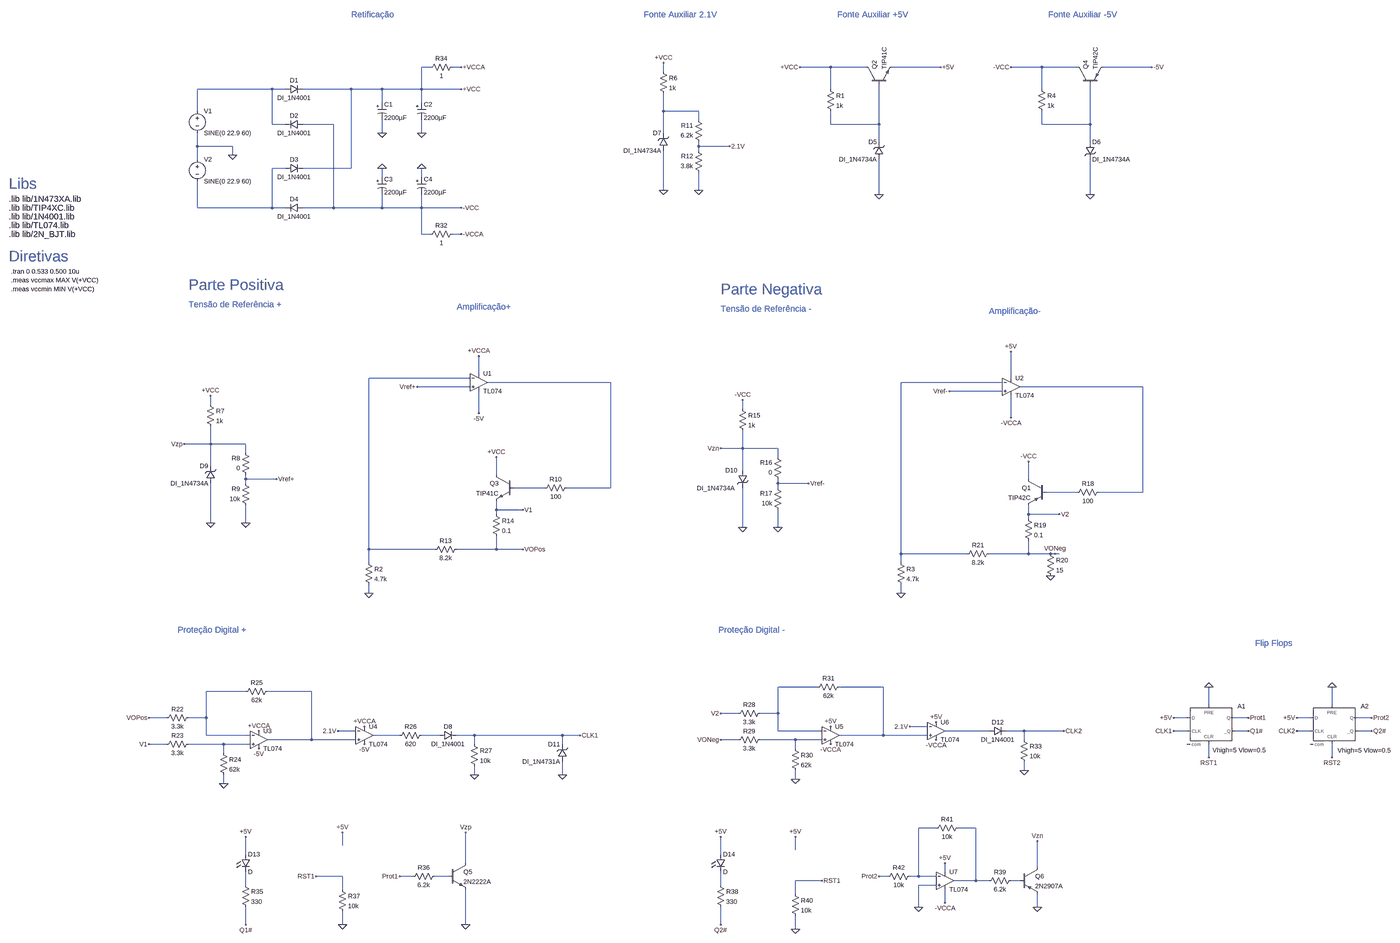
[diagram p0: schematic FonteCC-ELT1.asc, whole sheet]
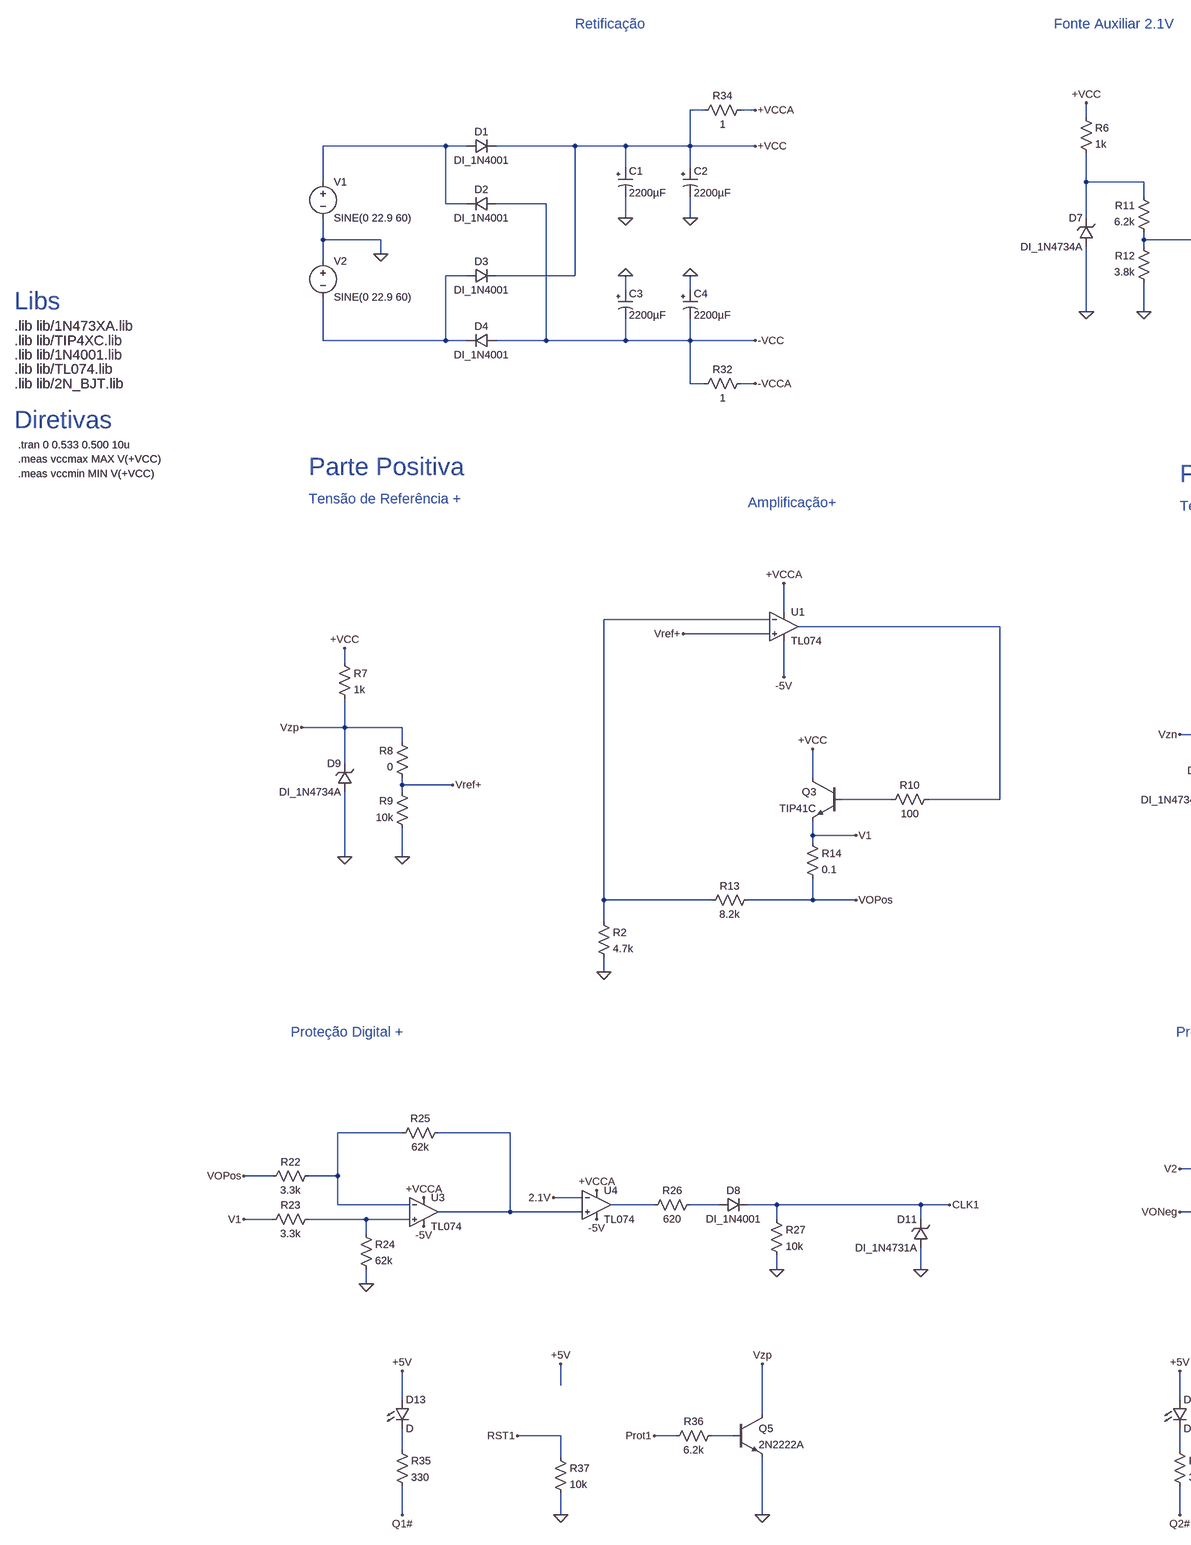
[diagram p1: schematic FonteCC-ELT1.asc, part, row 1 of 1, column 1 of 2]
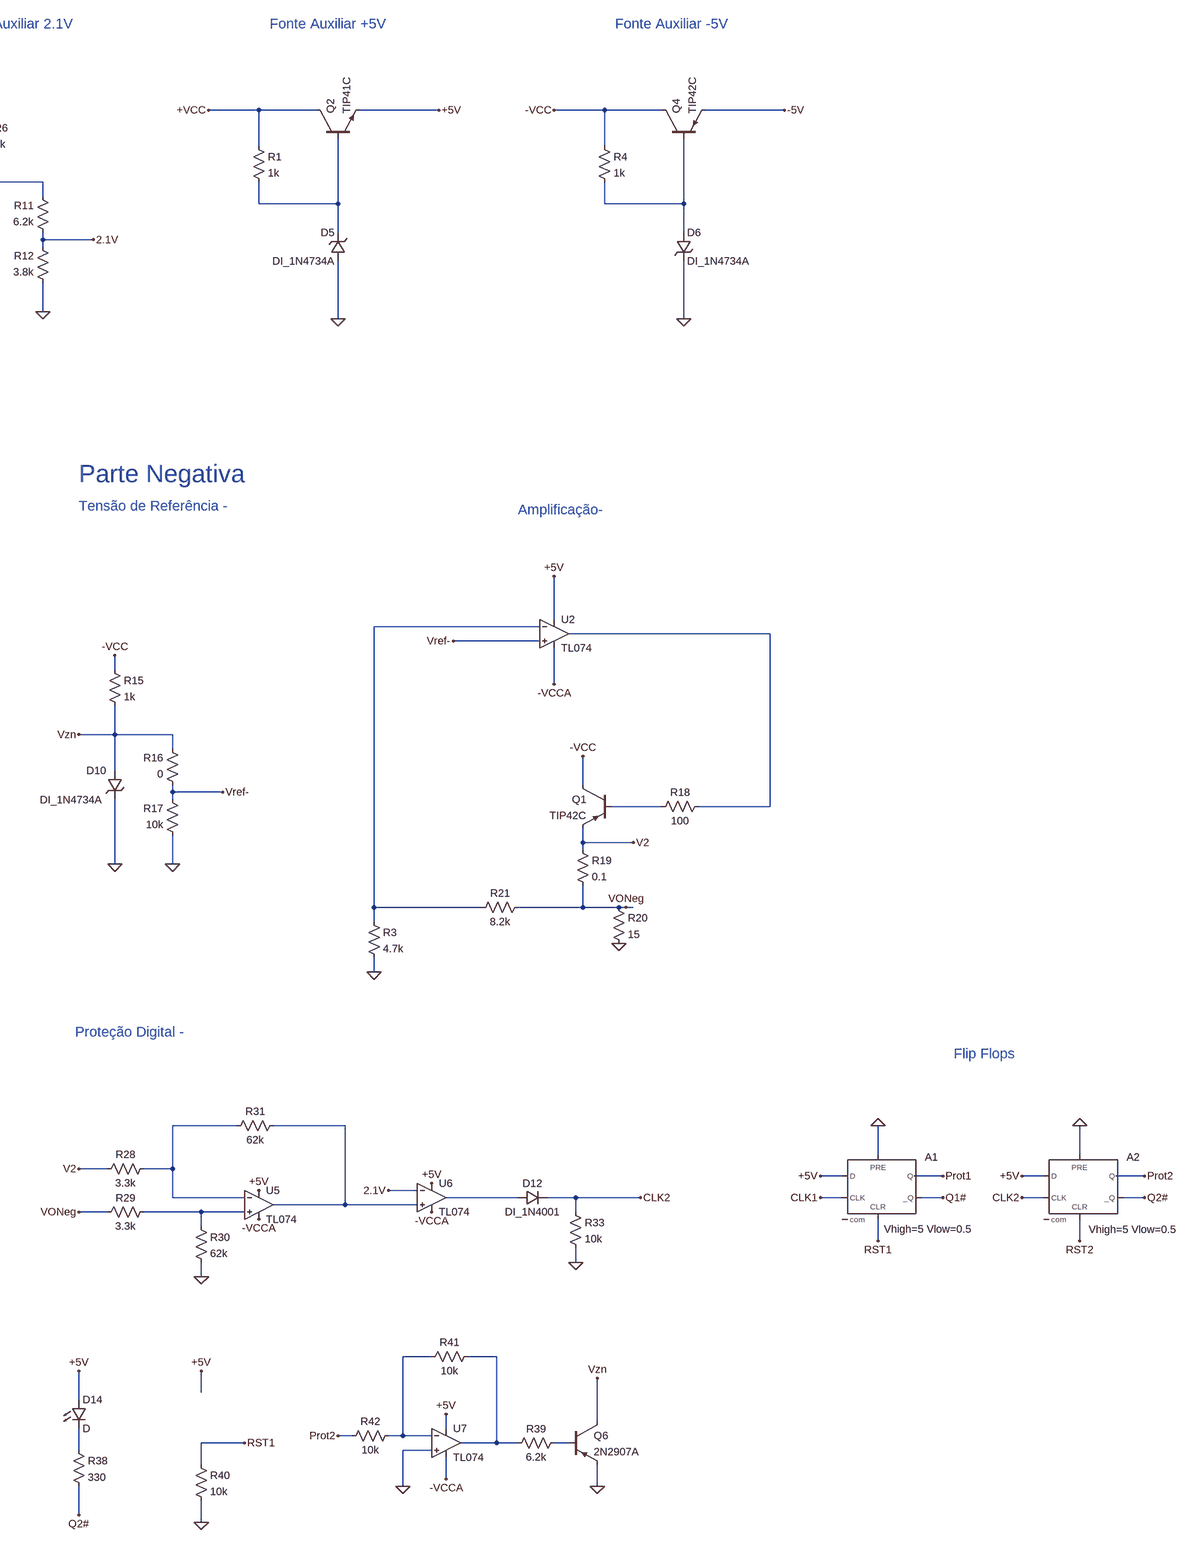
[diagram p2: schematic FonteCC-ELT1.asc, part, row 1 of 1, column 2 of 2]
FonteCC-ELT1.asc, the LTspice schematic file:
Version 4.1
SHEET 1 4036 3412
WIRE -48 -352 -80 -352
WIRE 64 -352 32 -352
WIRE 1408 -352 1296 -352
WIRE 1536 -352 1408 -352
WIRE 1808 -352 1632 -352
WIRE 2176 -352 2064 -352
WIRE 2304 -352 2176 -352
WIRE 2576 -352 2400 -352
WIRE 800 -336 800 -368
WIRE -624 -272 -896 -272
WIRE -576 -272 -624 -272
WIRE -336 -272 -512 -272
WIRE -224 -272 -336 -272
WIRE -80 -272 -80 -352
WIRE -80 -272 -224 -272
WIRE 64 -272 -80 -272
WIRE 1408 -272 1408 -352
WIRE 2176 -272 2176 -352
WIRE -224 -224 -224 -272
WIRE -80 -224 -80 -272
WIRE -896 -192 -896 -272
WIRE 800 -192 800 -256
WIRE 928 -192 800 -192
WIRE 928 -160 928 -192
WIRE -624 -144 -624 -272
WIRE -576 -144 -624 -144
WIRE -400 -144 -512 -144
WIRE 1408 -144 1408 -192
WIRE 1584 -144 1584 -288
WIRE 1584 -144 1408 -144
WIRE 2176 -144 2176 -192
WIRE 2352 -144 2352 -288
WIRE 2352 -144 2176 -144
WIRE -224 -112 -224 -160
WIRE -80 -112 -80 -160
WIRE 800 -112 800 -192
WIRE 1584 -80 1584 -144
WIRE 2352 -80 2352 -144
WIRE -896 -64 -896 -112
WIRE -768 -64 -896 -64
WIRE 928 -64 928 -80
WIRE 1040 -64 928 -64
WIRE 928 -48 928 -64
WIRE -768 -32 -768 -64
WIRE -896 -16 -896 -64
WIRE -576 16 -624 16
WIRE -336 16 -336 -272
WIRE -336 16 -512 16
WIRE -224 48 -224 16
WIRE -80 48 -80 16
WIRE 800 96 800 -48
WIRE 928 96 928 32
WIRE 1584 112 1584 -16
WIRE 2352 112 2352 -16
WIRE -896 160 -896 64
WIRE -624 160 -624 16
WIRE -624 160 -896 160
WIRE -576 160 -624 160
WIRE -400 160 -400 -144
WIRE -400 160 -512 160
WIRE -224 160 -224 112
WIRE -224 160 -400 160
WIRE -80 160 -80 112
WIRE -80 160 -224 160
WIRE 64 160 -80 160
WIRE -80 256 -80 160
WIRE -48 256 -80 256
WIRE 64 256 32 256
WIRE 128 784 128 720
WIRE 96 800 -272 800
WIRE 2064 800 2064 704
WIRE 608 816 160 816
WIRE 2032 816 1664 816
WIRE 96 832 -96 832
WIRE 2544 832 2096 832
WIRE 2032 848 1840 848
WIRE -848 896 -848 864
WIRE 1088 912 1088 880
WIRE 128 928 128 848
WIRE 2064 944 2064 864
WIRE -848 1040 -848 976
WIRE -848 1040 -944 1040
WIRE -720 1040 -848 1040
WIRE 1088 1056 1088 992
WIRE 1088 1056 1008 1056
WIRE 1216 1056 1088 1056
WIRE -720 1072 -720 1040
WIRE 1216 1088 1216 1056
WIRE -848 1120 -848 1040
WIRE 1088 1136 1088 1056
WIRE 192 1152 192 1088
WIRE -720 1168 -720 1152
WIRE -608 1168 -720 1168
WIRE 2128 1168 2128 1104
WIRE -720 1184 -720 1168
WIRE 1216 1184 1216 1168
WIRE 1328 1184 1216 1184
WIRE 368 1200 256 1200
WIRE 608 1200 608 816
WIRE 608 1200 448 1200
WIRE 1216 1200 1216 1184
WIRE 2304 1216 2192 1216
WIRE 2544 1216 2544 832
WIRE 2544 1216 2384 1216
WIRE 192 1280 192 1248
WIRE 288 1280 192 1280
WIRE 192 1296 192 1280
WIRE 2128 1296 2128 1264
WIRE 2240 1296 2128 1296
WIRE 2128 1312 2128 1296
WIRE -848 1328 -848 1184
WIRE -720 1328 -720 1264
WIRE 1088 1344 1088 1200
WIRE 1216 1344 1216 1280
WIRE -272 1424 -272 800
WIRE -32 1424 -272 1424
WIRE 192 1424 192 1376
WIRE 192 1424 48 1424
WIRE 288 1424 192 1424
WIRE 1664 1440 1664 816
WIRE 1904 1440 1664 1440
WIRE 2128 1440 2128 1392
WIRE 2128 1440 1984 1440
WIRE 2208 1440 2128 1440
WIRE 2224 1440 2208 1440
WIRE 2240 1440 2224 1440
WIRE -272 1472 -272 1424
WIRE 1664 1472 1664 1440
WIRE -272 1584 -272 1552
WIRE 1664 1584 1664 1552
WIRE 1360 1952 1216 1952
WIRE 1600 1952 1440 1952
WIRE -720 1968 -864 1968
WIRE -480 1968 -640 1968
WIRE 2784 2016 2784 1952
WIRE 3232 2016 3232 1952
WIRE 1072 2048 1008 2048
WIRE 1216 2048 1216 1952
WIRE 1216 2048 1152 2048
WIRE -1008 2064 -1072 2064
WIRE -864 2064 -864 1968
WIRE -864 2064 -928 2064
WIRE 2704 2064 2656 2064
WIRE 2928 2064 2864 2064
WIRE 3152 2064 3104 2064
WIRE 3376 2064 3312 2064
WIRE 1760 2096 1696 2096
WIRE -320 2112 -384 2112
WIRE 1216 2112 1216 2048
WIRE 1376 2112 1216 2112
WIRE 1984 2112 1824 2112
WIRE 2112 2112 2048 2112
WIRE 2256 2112 2112 2112
WIRE 2704 2112 2656 2112
WIRE 2928 2112 2880 2112
WIRE 3152 2112 3104 2112
WIRE 3376 2112 3328 2112
WIRE -864 2128 -864 2064
WIRE -704 2128 -864 2128
WIRE -160 2128 -256 2128
WIRE -16 2128 -80 2128
WIRE 112 2128 48 2128
WIRE 432 2128 112 2128
WIRE 496 2128 432 2128
WIRE 1600 2128 1600 1952
WIRE 1600 2128 1440 2128
WIRE 1760 2128 1600 2128
WIRE -480 2144 -480 1968
WIRE -480 2144 -640 2144
WIRE -320 2144 -480 2144
WIRE 1072 2144 1008 2144
WIRE 1280 2144 1152 2144
WIRE 1376 2144 1280 2144
WIRE 2112 2144 2112 2112
WIRE -1008 2160 -1072 2160
WIRE -800 2160 -928 2160
WIRE -704 2160 -800 2160
WIRE 112 2160 112 2128
WIRE 432 2160 432 2128
WIRE 1280 2176 1280 2144
WIRE -800 2192 -800 2160
WIRE 2784 2208 2784 2160
WIRE 3232 2208 3232 2160
WIRE 2112 2256 2112 2224
WIRE 112 2272 112 2240
WIRE 432 2272 432 2224
WIRE 1280 2288 1280 2256
WIRE -800 2304 -800 2272
WIRE 1792 2512 1728 2512
WIRE 1936 2512 1872 2512
WIRE -368 2576 -368 2528
WIRE 1280 2592 1280 2544
WIRE -720 2608 -720 2544
WIRE 1008 2608 1008 2544
WIRE 80 2640 80 2528
WIRE 2160 2656 2160 2560
WIRE 1824 2672 1824 2640
WIRE -368 2688 -464 2688
WIRE -112 2688 -160 2688
WIRE 16 2688 -32 2688
WIRE 1616 2688 1584 2688
WIRE 1728 2688 1728 2512
WIRE 1728 2688 1696 2688
WIRE 1792 2688 1728 2688
WIRE 1376 2704 1280 2704
WIRE 1936 2704 1936 2512
WIRE 1936 2704 1856 2704
WIRE 1984 2704 1936 2704
WIRE 2096 2704 2064 2704
WIRE -720 2720 -720 2672
WIRE 1008 2720 1008 2672
WIRE 1792 2720 1728 2720
WIRE -368 2736 -368 2688
WIRE 1280 2752 1280 2704
WIRE 1824 2784 1824 2736
WIRE 1728 2800 1728 2720
WIRE 2160 2800 2160 2752
WIRE -720 2864 -720 2800
WIRE -368 2864 -368 2816
WIRE 80 2864 80 2736
WIRE 1008 2864 1008 2800
WIRE 1280 2880 1280 2832
FLAG -608 1168 Vref+
FLAG -848 1328 0
FLAG -848 864 +VCC
FLAG -720 1328 0
FLAG 128 928 -5V
FLAG 192 1088 +VCC
FLAG -96 832 Vref+
FLAG -272 1584 0
FLAG 288 1424 VOPos
FLAG 1328 1184 Vref-
FLAG 1088 1344 0
FLAG 1088 880 -VCC
FLAG 1216 1344 0
FLAG 2064 704 +5V
FLAG 2128 1104 -VCC
FLAG 1840 848 Vref-
FLAG 1664 1584 0
FLAG 2224 1440 VONeg
FLAG -768 -32 0
FLAG 64 -272 +VCC
FLAG 64 160 -VCC
FLAG -80 -112 0
FLAG -80 16 0
FLAG 1584 112 0
FLAG 1296 -352 +VCC
FLAG 1808 -352 +5V
FLAG 2352 112 0
FLAG 2064 -352 -VCC
FLAG 2576 -352 -5V
FLAG 1040 -64 2.1V
FLAG 800 96 0
FLAG 800 -368 +VCC
FLAG 928 96 0
FLAG 2208 1520 0
FLAG -800 2304 0
FLAG -1072 2064 VOPos
FLAG -1072 2160 V1
FLAG 288 1280 V1
FLAG -672 2112 +VCCA
FLAG -672 2176 -5V
FLAG -384 2112 2.1V
FLAG -288 2096 +VCCA
FLAG -288 2160 -5V
FLAG 432 2272 0
FLAG 112 2272 0
FLAG 496 2128 CLK1
FLAG 1280 2288 0
FLAG 1008 2048 V2
FLAG 1008 2144 VONeg
FLAG 1408 2096 +5V
FLAG 1408 2160 -VCCA
FLAG 1696 2096 2.1V
FLAG 1792 2080 +5V
FLAG 1792 2144 -VCCA
FLAG 2112 2256 0
FLAG 2256 2112 CLK2
FLAG 128 720 +VCCA
FLAG 2064 944 -VCCA
FLAG 2784 1952 0
FLAG 2928 2064 Prot1
FLAG 2928 2112 Q1#
FLAG 2656 2064 +5V
FLAG 2656 2112 CLK1
FLAG 2784 2208 RST1
FLAG 3232 1952 0
FLAG 3376 2064 Prot2
FLAG 3376 2112 Q2#
FLAG 3104 2064 +5V
FLAG 3104 2112 CLK2
FLAG 3232 2208 RST2
FLAG -720 2544 +5V
FLAG -720 2864 Q1#
FLAG -160 2688 Prot1
FLAG 80 2864 0
FLAG 80 2528 Vzp
FLAG -368 2864 0
FLAG -368 2528 +5V
FLAG 1008 2544 +5V
FLAG 1008 2864 Q2#
FLAG 1280 2880 0
FLAG 1376 2704 RST1
FLAG 1280 2544 +5V
FLAG -464 2688 RST1
FLAG 1008 1056 Vzn
FLAG 1824 2640 +5V
FLAG 1824 2784 -VCCA
FLAG 1728 2800 0
FLAG 1584 2688 Prot2
FLAG 2160 2800 0
FLAG 2160 2560 Vzn
FLAG 2240 1296 V2
FLAG 64 256 -VCCA
FLAG 64 -352 +VCCA
FLAG -944 1040 Vzp
FLAG -224 -112 0
FLAG -224 16 0
SYMBOL res -864 880 R0
SYMATTR InstName R7
SYMATTR Value 1k
SYMBOL zener -832 1184 R180
WINDOW 0 24 64 Left 2
WINDOW 3 24 0 Left 2
SYMATTR InstName D9
SYMATTR Value DI_1N4734A
SYMATTR Prefix X
SYMBOL res -704 1168 R180
WINDOW 0 36 76 Left 2
WINDOW 3 36 40 Left 2
SYMATTR InstName R8
SYMATTR Value 0
SYMBOL res -704 1280 R180
WINDOW 0 36 76 Left 2
WINDOW 3 36 40 Left 2
SYMATTR InstName R9
SYMATTR Value 10k
SYMBOL npn 256 1152 M0
SYMATTR InstName Q3
SYMATTR Value TIP41C
SYMBOL res 464 1184 R90
WINDOW 0 0 56 VBottom 2
WINDOW 3 32 56 VTop 2
SYMATTR InstName R10
SYMATTR Value 100
SYMBOL res 64 1408 R90
WINDOW 0 0 56 VBottom 2
WINDOW 3 32 56 VTop 2
SYMATTR InstName R13
SYMATTR Value 8.2k
SYMBOL res 1072 896 R0
SYMATTR InstName R15
SYMATTR Value 1k
SYMBOL zener 1072 1136 R0
WINDOW 0 -47 0 Left 2
WINDOW 3 -151 65 Left 2
SYMATTR InstName D10
SYMATTR Value DI_1N4734A
SYMATTR Prefix X
SYMBOL res 1232 1184 R180
WINDOW 0 36 76 Left 2
WINDOW 3 36 40 Left 2
SYMATTR InstName R16
SYMATTR Value 0
SYMBOL res 1232 1296 R180
WINDOW 0 36 76 Left 2
WINDOW 3 36 40 Left 2
SYMATTR InstName R17
SYMATTR Value 10k
SYMBOL res 2400 1200 R90
WINDOW 0 0 56 VBottom 2
WINDOW 3 32 56 VTop 2
SYMATTR InstName R18
SYMATTR Value 100
SYMBOL res 2000 1424 R90
WINDOW 0 0 56 VBottom 2
WINDOW 3 32 56 VTop 2
SYMATTR InstName R21
SYMATTR Value 8.2k
SYMBOL res -288 1456 R0
SYMATTR InstName R2
SYMATTR Value 4.7k
SYMBOL res 1648 1456 R0
SYMATTR InstName R3
SYMATTR Value 4.7k
SYMBOL pnp 2192 1168 M0
SYMATTR InstName Q1
SYMATTR Value TIP42C
SYMBOL diode -576 -256 R270
WINDOW 0 32 32 VTop 2
WINDOW 3 0 32 VBottom 2
SYMATTR InstName D1
SYMATTR Value DI_1N4001
SYMBOL diode -512 -160 R90
WINDOW 0 0 32 VBottom 2
WINDOW 3 32 32 VTop 2
SYMATTR InstName D2
SYMATTR Value DI_1N4001
SYMBOL diode -576 32 R270
WINDOW 0 32 32 VTop 2
WINDOW 3 0 32 VBottom 2
SYMATTR InstName D3
SYMATTR Value DI_1N4001
SYMBOL diode -512 144 R90
WINDOW 0 0 32 VBottom 2
WINDOW 3 32 32 VTop 2
SYMATTR InstName D4
SYMATTR Value DI_1N4001
SYMBOL voltage -896 -208 R0
WINDOW 123 0 0 Left 0
WINDOW 39 0 0 Left 0
SYMATTR InstName V1
SYMATTR Value SINE(0 22.9 60)
SYMBOL voltage -896 -32 R0
WINDOW 123 0 0 Left 0
WINDOW 39 0 0 Left 0
SYMATTR InstName V2
SYMATTR Value SINE(0 22.9 60)
SYMBOL polcap -96 -224 R0
SYMATTR InstName C2
SYMATTR Value 2200µF
SYMBOL polcap -96 48 R0
SYMATTR InstName C4
SYMATTR Value 2200µF
SYMBOL npn 1536 -288 R270
SYMATTR InstName Q2
SYMATTR Value TIP41C
SYMBOL res 1392 -288 R0
SYMATTR InstName R1
SYMATTR Value 1k
SYMBOL zener 1600 -16 R180
WINDOW 0 24 64 Left 2
WINDOW 3 24 0 Left 2
SYMATTR InstName D5
SYMATTR Value DI_1N4734A
SYMATTR Prefix X
SYMBOL res 2160 -288 R0
SYMATTR InstName R4
SYMATTR Value 1k
SYMBOL zener 2336 -80 R0
SYMATTR InstName D6
SYMATTR Value DI_1N4734A
SYMATTR Prefix X
SYMBOL pnp 2304 -288 R270
SYMATTR InstName Q4
SYMATTR Value TIP42C
SYMBOL res 784 -352 R0
SYMATTR InstName R6
SYMATTR Value 1k
SYMBOL zener 816 -48 R180
WINDOW 0 24 64 Left 2
WINDOW 3 24 0 Left 2
SYMATTR InstName D7
SYMATTR Value DI_1N4734A
SYMATTR Prefix X
SYMBOL res 944 -64 R180
WINDOW 0 36 76 Left 2
WINDOW 3 36 40 Left 2
SYMATTR InstName R11
SYMATTR Value 6.2k
SYMBOL res 944 48 R180
WINDOW 0 36 76 Left 2
WINDOW 3 36 40 Left 2
SYMATTR InstName R12
SYMATTR Value 3.8k
SYMBOL res 2192 1424 R0
SYMATTR InstName R20
SYMATTR Value 15
SYMBOL res 176 1280 R0
SYMATTR InstName R14
SYMATTR Value 0.1
SYMBOL res 2112 1296 R0
SYMATTR InstName R19
SYMATTR Value 0.1
SYMBOL res -912 2048 R90
WINDOW 0 0 56 VBottom 2
WINDOW 3 32 56 VTop 2
SYMATTR InstName R22
SYMATTR Value 3.3k
SYMBOL res -912 2144 R90
WINDOW 0 0 56 VBottom 2
WINDOW 3 32 56 VTop 2
SYMATTR InstName R23
SYMATTR Value 3.3k
SYMBOL res -816 2176 R0
SYMATTR InstName R24
SYMATTR Value 62k
SYMBOL res -624 1952 R90
WINDOW 0 0 56 VBottom 2
WINDOW 3 32 56 VTop 2
SYMATTR InstName R25
SYMATTR Value 62k
SYMBOL res -64 2112 R90
WINDOW 0 0 56 VBottom 2
WINDOW 3 32 56 VTop 2
SYMATTR InstName R26
SYMATTR Value 620
SYMBOL diode -16 2144 R270
WINDOW 0 32 32 VTop 2
WINDOW 3 0 32 VBottom 2
SYMATTR InstName D8
SYMATTR Value DI_1N4001
SYMBOL res 96 2144 R0
SYMATTR InstName R27
SYMATTR Value 10k
SYMBOL zener 448 2224 R180
WINDOW 0 24 64 Left 2
WINDOW 3 24 0 Left 2
SYMATTR InstName D11
SYMATTR Value DI_1N4731A
SYMBOL res 1168 2032 R90
WINDOW 0 0 56 VBottom 2
WINDOW 3 32 56 VTop 2
SYMATTR InstName R28
SYMATTR Value 3.3k
SYMBOL res 1168 2128 R90
WINDOW 0 0 56 VBottom 2
WINDOW 3 32 56 VTop 2
SYMATTR InstName R29
SYMATTR Value 3.3k
SYMBOL res 1264 2160 R0
SYMATTR InstName R30
SYMATTR Value 62k
SYMBOL res 1456 1936 R90
WINDOW 0 0 56 VBottom 2
WINDOW 3 32 56 VTop 2
SYMATTR InstName R31
SYMATTR Value 62k
SYMBOL diode 1984 2128 R270
WINDOW 0 32 32 VTop 2
WINDOW 3 0 32 VBottom 2
SYMATTR InstName D12
SYMATTR Value DI_1N4001
SYMBOL res 2096 2128 R0
SYMATTR InstName R33
SYMATTR Value 10k
SYMBOL OpAmps\\opamp2 128 752 R0
SYMATTR InstName U1
SYMATTR Value TL074
SYMBOL OpAmps\\opamp2 2064 768 R0
SYMATTR InstName U2
SYMATTR Value TL074
SYMBOL OpAmps\\opamp2 -672 2080 R0
SYMATTR InstName U3
SYMATTR Value TL074
SYMBOL OpAmps\\opamp2 -288 2064 R0
SYMATTR InstName U4
SYMATTR Value TL074
SYMBOL OpAmps\\opamp2 1408 2064 R0
SYMATTR InstName U5
SYMATTR Value TL074
SYMBOL OpAmps\\opamp2 1792 2048 R0
SYMATTR InstName U6
SYMATTR Value TL074
SYMBOL Digital\\dflop 2784 2016 R0
WINDOW 39 13 166 Left 2
SYMATTR SpiceLine Vhigh=5 Vlow=0.5
SYMATTR InstName A1
SYMBOL Digital\\dflop 3232 2016 R0
WINDOW 39 20 167 Left 2
SYMATTR SpiceLine Vhigh=5 Vlow=0.5
SYMATTR InstName A2
SYMBOL LED -736 2608 R0
SYMATTR InstName D13
SYMBOL res -736 2704 R0
SYMATTR InstName R35
SYMATTR Value 330
SYMBOL npn 16 2640 R0
SYMATTR InstName Q5
SYMATTR Value 2N2222A
SYMBOL res -384 2720 R0
SYMATTR InstName R37
SYMATTR Value 10k
SYMBOL LED 992 2608 R0
SYMATTR InstName D14
SYMBOL res 992 2704 R0
SYMATTR InstName R38
SYMATTR Value 330
SYMBOL res 1264 2736 R0
SYMATTR InstName R40
SYMATTR Value 10k
SYMBOL OpAmps\\opamp2 1824 2640 R0
SYMATTR InstName U7
SYMATTR Value TL074
SYMBOL pnp 2096 2656 R0
SYMATTR InstName Q6
SYMATTR Value 2N2907A
SYMBOL res -16 2672 R90
WINDOW 0 0 56 VBottom 2
WINDOW 3 32 56 VTop 2
SYMATTR InstName R36
SYMATTR Value 6.2k
SYMBOL res 2080 2688 R90
WINDOW 0 0 56 VBottom 2
WINDOW 3 32 56 VTop 2
SYMATTR InstName R39
SYMATTR Value 6.2k
SYMBOL res 1888 2496 R90
WINDOW 0 0 56 VBottom 2
WINDOW 3 32 56 VTop 2
SYMATTR InstName R41
SYMATTR Value 10k
SYMBOL res 1712 2672 R90
WINDOW 0 0 56 VBottom 2
WINDOW 3 32 56 VTop 2
SYMATTR InstName R42
SYMATTR Value 10k
SYMBOL res 48 240 R90
WINDOW 0 0 56 VBottom 2
WINDOW 3 32 56 VTop 2
SYMATTR InstName R32
SYMATTR Value 1
SYMBOL res 48 -368 R90
WINDOW 0 0 56 VBottom 2
WINDOW 3 32 56 VTop 2
SYMATTR InstName R34
SYMATTR Value 1
SYMBOL polcap -240 -224 R0
SYMATTR InstName C1
SYMATTR Value 2200µF
SYMBOL polcap -240 48 R0
SYMATTR InstName C3
SYMATTR Value 2200µF
TEXT 728 -544 Left 3 ;Fonte Auxiliar 2.1V
TEXT 1432 -544 Left 3 ;Fonte Auxiliar +5V
TEXT 2200 -544 Left 3 ;Fonte Auxiliar -5V
TEXT -928 440 Left 5 ;Parte Positiva
TEXT -928 512 Left 3 ;Tensão de Referência +
TEXT 48 520 Left 3 ;Amplificação+
TEXT 1008 456 Left 5 ;Parte Negativa
TEXT 1008 528 Left 3 ;Tensão de Referência -
TEXT 1984 536 Left 3 ;Amplificação-
TEXT -1992 128 Left 3 !.lib lib/1N473XA.lib
TEXT -1992 72 Left 5 ;Libs
TEXT -1992 160 Left 3 !.lib lib/TIP4XC.lib
TEXT -1992 192 Left 3 !.lib lib/1N4001.lib
TEXT -1992 224 Left 3 !.lib lib/TL074.lib
TEXT -1984 392 Left 2 !.tran 0 0.533 0.500 10u
TEXT -336 -544 Left 3 ;Retificação
TEXT -968 1744 Left 3 ;Proteção Digital +
TEXT 1000 1744 Left 3 ;Proteção Digital -
TEXT 2952 1792 Left 3 ;Flip Flops
TEXT -1992 336 Left 5 ;Diretivas
TEXT -1984 424 Left 2 !.meas vccmax MAX V(+VCC)
TEXT -1984 456 Left 2 !.meas vccmin MIN V(+VCC)
TEXT -1992 256 Left 3 !.lib lib/2N_BJT.lib

The netlist it stands for:
* FonteCC-ELT1.asc
R7 +VCC Vzp 1k
X§D9 0 Vzp DI_1N4734A  ; pins + -
R8 Vref+ Vzp 0
R9 0 Vref+ 10k
Q3 +VCC N010 V1 0 TIP41C
R10 N007 N010 100
R13 VOPos N006 8.2k
R15 -VCC Vzn 1k
X§D10 Vzn 0 DI_1N4734A  ; pins + -
R16 Vref- Vzn 0
R17 0 Vref- 10k
R18 N009 N011 100
R21 VONeg N008 8.2k
R2 N006 0 4.7k
R3 N008 0 4.7k
Q1 -VCC N011 V2 0 TIP42C
D1 N001 +VCC DI_1N4001
D2 -VCC N001 DI_1N4001
D3 N005 +VCC DI_1N4001
D4 -VCC N005 DI_1N4001
V1 N001 0 SINE(0 22.9 60)
V2 0 N005 SINE(0 22.9 60)
C2 +VCC 0 2200µF
C4 0 -VCC 2200µF
Q2 +VCC N003 +5V 0 TIP41C
R1 +VCC N003 1k
X§D5 0 N003 DI_1N4734A  ; pins + -
R4 -VCC N004 1k
X§D6 N004 0 DI_1N4734A  ; pins + -
Q4 -VCC N004 -5V 0 TIP42C
R6 +VCC N002 1k
X§D7 0 N002 DI_1N4734A  ; pins + -
R11 2.1V N002 6.2k
R12 0 2.1V 3.8k
R20 VONeg 0 15
R14 V1 VOPos 0.1
R19 V2 VONeg 0.1
R22 N014 VOPos 3.3k
R23 N020 V1 3.3k
R24 N020 0 62k
R25 N015 N014 62k
R26 N018 N017 620
D8 N018 CLK1 DI_1N4001
R27 CLK1 0 10k
D11 0 CLK1 DI_1N4731A
R28 N012 V2 3.3k
R29 N019 VONeg 3.3k
R30 N019 0 62k
R31 N013 N012 62k
D12 N016 CLK2 DI_1N4001
R33 CLK2 0 10k
X§U1 Vref+ N006 +VCCA -5V N007 TL074  ; pins In+ In- V+ V- OUT
X§U2 Vref- N008 +5V -VCCA N009 TL074  ; pins In+ In- V+ V- OUT
X§U3 N020 N014 +VCCA -5V N015 TL074  ; pins In+ In- V+ V- OUT
X§U4 N015 2.1V +VCCA -5V N017 TL074  ; pins In+ In- V+ V- OUT
X§U5 N019 N012 +5V -VCCA N013 TL074  ; pins In+ In- V+ V- OUT
X§U6 N013 2.1V +5V -VCCA N016 TL074  ; pins In+ In- V+ V- OUT
A1 +5V 0 CLK1 0 RST1 Q1# Prot1 0 DFLOP Vhigh=5 Vlow=0.5
A2 +5V 0 CLK2 0 RST2 Q2# Prot2 0 DFLOP Vhigh=5 Vlow=0.5
D13 +5V N025 D
R35 N025 Q1# 330
Q5 Vzp N023 0 0 2N2222A
R37 RST1 0 10k
D14 +5V N026 D
R38 N026 Q2# 330
R40 RST1 0 10k
X§U7 0 N021 +5V -VCCA N022 TL074  ; pins In+ In- V+ V- OUT
Q6 Vzn N024 0 0 2N2907A
R36 N023 Prot1 6.2k
R39 N024 N022 6.2k
R41 N022 N021 10k
R42 N021 Prot2 10k
R32 -VCCA -VCC 1
R34 +VCCA +VCC 1
C1 +VCC 0 2200µF
C3 0 -VCC 2200µF
.model D D
.lib standard.dio
.model NPN NPN
.model PNP PNP
.lib standard.bjt
* Fonte Auxiliar 2.1V
* Fonte Auxiliar +5V
* Fonte Auxiliar -5V
* Parte Positiva
* Tensão de Referência +
* Amplificação+
* Parte Negativa
* Tensão de Referência -
* Amplificação-
.lib lib/1N473XA.lib
* Libs
.lib lib/TIP4XC.lib
.lib lib/1N4001.lib
.lib lib/TL074.lib
.tran 0 0.533 0.500 10u
* Retificação
* Proteção Digital +
* Proteção Digital -
* Flip Flops
* Diretivas
.meas vccmax MAX V(+VCC)
.meas vccmin MIN V(+VCC)
.lib lib/2N_BJT.lib
.backanno
.end